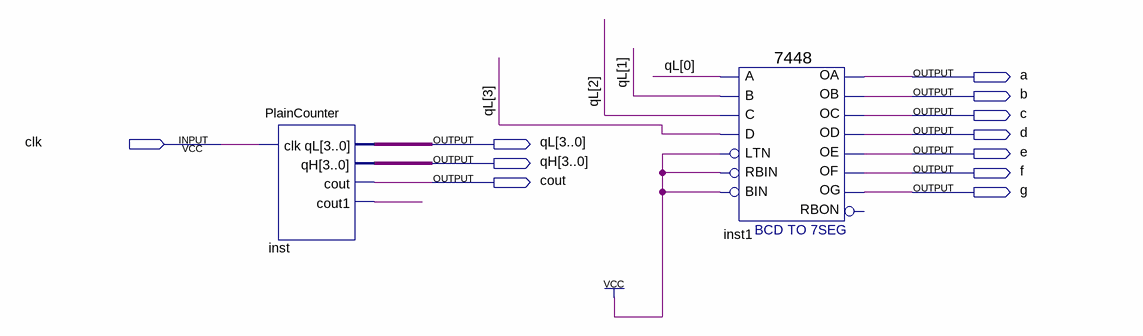
[diagram p0: schematic sheet]
// Quartus schematic 11Counter.bdf as structural Verilog: 2 symbols, 11 pins
module \11Counter  (
  input  clk,
  output a,
  output b,
  output c,
  output d,
  output [3:0] qL,
  output e,
  output [3:0] qH,
  output f,
  output cout,
  output g
);

  wire inst_cout1;

  PlainCounter inst (.clk(clk), .qL(qL), .qH(qH), .cout(cout), .cout1(inst_cout1));
  \7448  inst1 (
    .A(qL[0]), .C(qL[2]), .D(qL[3]), .B(qL[1]), .RBIN(1'b1), .BIN(1'b1), .LTN(1'b1), .OC(c), .OE(e), .OD(d),
    .OF(f), .OG(g), .OB(b), .OA(a));  // open: RBON
endmodule
